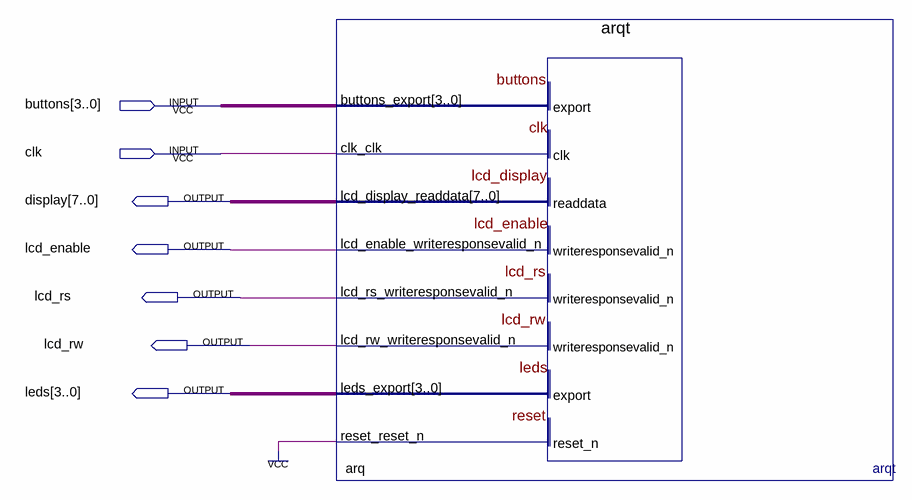
[diagram p0: schematic sheet]
// Quartus schematic problema1.bdf as structural Verilog: 1 symbols, 7 pins
module problema1 (
  input  [3:0] buttons,
  input  clk,
  output [7:0] display,
  output lcd_enable,
  output lcd_rs,
  output lcd_rw,
  output [3:0] leds
);

  arqt arq (
    .buttons_export(buttons), .clk_clk(clk), .reset_reset_n(1'b1), .lcd_display_readdata(display),
    .lcd_enable_writeresponsevalid_n(lcd_enable), .lcd_rs_writeresponsevalid_n(lcd_rs),
    .lcd_rw_writeresponsevalid_n(lcd_rw), .leds_export(leds));
endmodule
